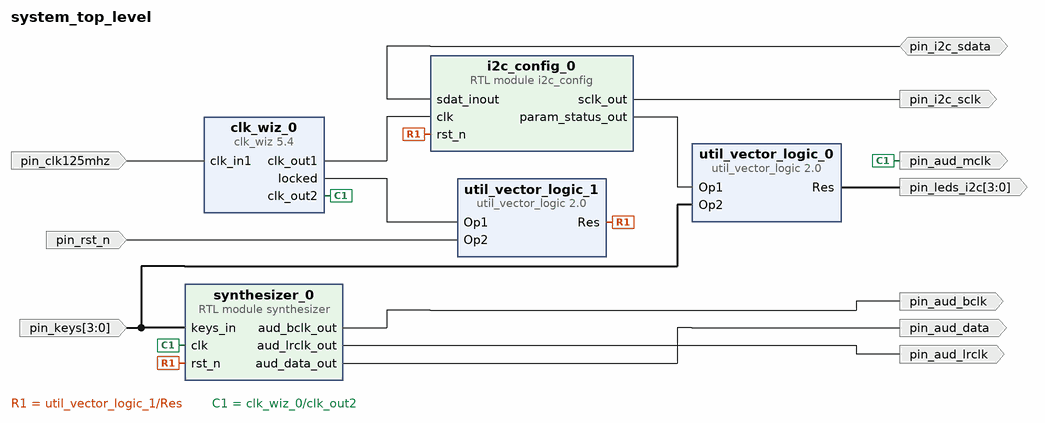
[diagram p0: block diagram of the top level]
# Vivado block design system_top_level, xc7z020clg400-1, Vivado 2017.2
create_bd_design system_top_level

create_bd_port -dir I -type clk pin_clk125mhz
set_property -dict {CONFIG.FREQ_HZ 125000000} [get_bd_ports pin_clk125mhz]
create_bd_port -dir I pin_rst_n
create_bd_port -dir I -from 3 -to 0 pin_keys
create_bd_port -dir O pin_aud_lrclk
create_bd_port -dir O pin_aud_data
create_bd_port -dir O pin_aud_bclk
create_bd_port -dir IO pin_i2c_sdata
create_bd_port -dir O pin_i2c_sclk
create_bd_port -dir O pin_aud_mclk
create_bd_port -dir O -from 3 -to 0 pin_leds_i2c

create_bd_cell -type ip -vlnv xilinx.com:ip:clk_wiz:5.4 clk_wiz_0
set_property -dict [list \
  CONFIG.USE_PHASE_ALIGNMENT false \
  CONFIG.PRIM_IN_FREQ 125.000 \
  CONFIG.USE_INCLK_SWITCHOVER false \
  CONFIG.SECONDARY_SOURCE Single_ended_clock_capable_pin \
  CONFIG.CLKIN1_JITTER_PS 80.0 \
  CONFIG.CLKIN2_JITTER_PS 133.33 \
  CONFIG.CLKOUT2_USED true \
  CONFIG.NUM_OUT_CLKS 2 \
  CONFIG.CLKOUT1_REQUESTED_OUT_FREQ 50.000 \
  CONFIG.CLKOUT2_REQUESTED_OUT_FREQ 12.288 \
  CONFIG.CLKOUT1_DRIVES BUFGCE \
  CONFIG.CLKOUT2_DRIVES BUFGCE \
  CONFIG.CLKOUT3_DRIVES BUFGCE \
  CONFIG.CLKOUT4_DRIVES BUFGCE \
  CONFIG.CLKOUT5_DRIVES BUFGCE \
  CONFIG.CLKOUT6_DRIVES BUFGCE \
  CONFIG.CLKOUT7_DRIVES BUFGCE \
  CONFIG.FEEDBACK_SOURCE FDBK_AUTO \
  CONFIG.USE_RESET false \
  CONFIG.MMCM_DIVCLK_DIVIDE 5 \
  CONFIG.MMCM_CLKFBOUT_MULT_F 29.000 \
  CONFIG.MMCM_CLKIN1_PERIOD 8.000 \
  CONFIG.MMCM_CLKIN2_PERIOD 10.0 \
  CONFIG.MMCM_CLKOUT0_DIVIDE_F 14.500 \
  CONFIG.MMCM_CLKOUT1_DIVIDE 59 \
  CONFIG.USE_SAFE_CLOCK_STARTUP true \
  CONFIG.CLKOUT1_JITTER 328.209 \
  CONFIG.CLKOUT1_PHASE_ERROR 293.530 \
  CONFIG.CLKOUT2_JITTER 425.475 \
  CONFIG.CLKOUT2_PHASE_ERROR 293.530 \
] [get_bd_cells clk_wiz_0]
create_bd_cell -type module -reference i2c_config i2c_config_0
create_bd_cell -type module -reference synthesizer synthesizer_0
create_bd_cell -type ip -vlnv xilinx.com:ip:util_vector_logic:2.0 util_vector_logic_0
set_property -dict {CONFIG.C_SIZE 4 CONFIG.C_OPERATION xor} [get_bd_cells util_vector_logic_0]
create_bd_cell -type ip -vlnv xilinx.com:ip:util_vector_logic:2.0 util_vector_logic_1
set_property -dict {CONFIG.C_SIZE 1} [get_bd_cells util_vector_logic_1]

# ---- connections ----

connect_bd_net -net clk_in1_1 [get_bd_ports pin_clk125mhz] [get_bd_pins clk_wiz_0/clk_in1]
connect_bd_net [get_bd_ports pin_rst_n] [get_bd_pins util_vector_logic_1/Op2]
connect_bd_net -net keys_in_1 [get_bd_ports pin_keys] [get_bd_pins synthesizer_0/keys_in] [get_bd_pins util_vector_logic_0/Op2]
connect_bd_net [get_bd_pins synthesizer_0/aud_lrclk_out] [get_bd_ports pin_aud_lrclk]
connect_bd_net [get_bd_pins synthesizer_0/aud_data_out] [get_bd_ports pin_aud_data]
connect_bd_net [get_bd_pins synthesizer_0/aud_bclk_out] [get_bd_ports pin_aud_bclk]
connect_bd_net [get_bd_ports pin_i2c_sdata] [get_bd_pins i2c_config_0/sdat_inout]
connect_bd_net [get_bd_pins i2c_config_0/sclk_out] [get_bd_ports pin_i2c_sclk]
connect_bd_net [get_bd_pins i2c_config_0/param_status_out] [get_bd_pins util_vector_logic_0/Op1]
connect_bd_net [get_bd_pins util_vector_logic_1/Res] [get_bd_pins synthesizer_0/rst_n] [get_bd_pins i2c_config_0/rst_n]
connect_bd_net [get_bd_pins clk_wiz_0/clk_out1] [get_bd_pins i2c_config_0/clk]
connect_bd_net [get_bd_pins clk_wiz_0/clk_out2] [get_bd_pins synthesizer_0/clk] [get_bd_ports pin_aud_mclk]
connect_bd_net [get_bd_pins clk_wiz_0/locked] [get_bd_pins util_vector_logic_1/Op1]
connect_bd_net [get_bd_pins util_vector_logic_0/Res] [get_bd_ports pin_leds_i2c]

validate_bd_design
save_bd_design
